# Altium schematic sheet Bridge.SchDoc: Full Bridge
size A4; ApprovedBy: LD Stanton; CheckedBy: None; Author: LD Stanton; CompanyName: University of Cape Town; DrawnBy: Lawrence Stanton; Engineer: Lawrence Stanton; Organization: University of Cape Town; Address1: Department of Electrical Engineering; Address2: Rondebosch; Address3: Cape Town; Address4: South Africa 7701; DocumentNumber: 1; SheetNumber: 1; SheetTotal: 1; Approv_Date_Eng: --/--/----; Approv_Date_Chk: --/--/----; PCB_Doc: TBD; ASM_Doc: TBD; FAB_Doc: TBD; CML_Doc: TBD; BOM_Doc: TBD
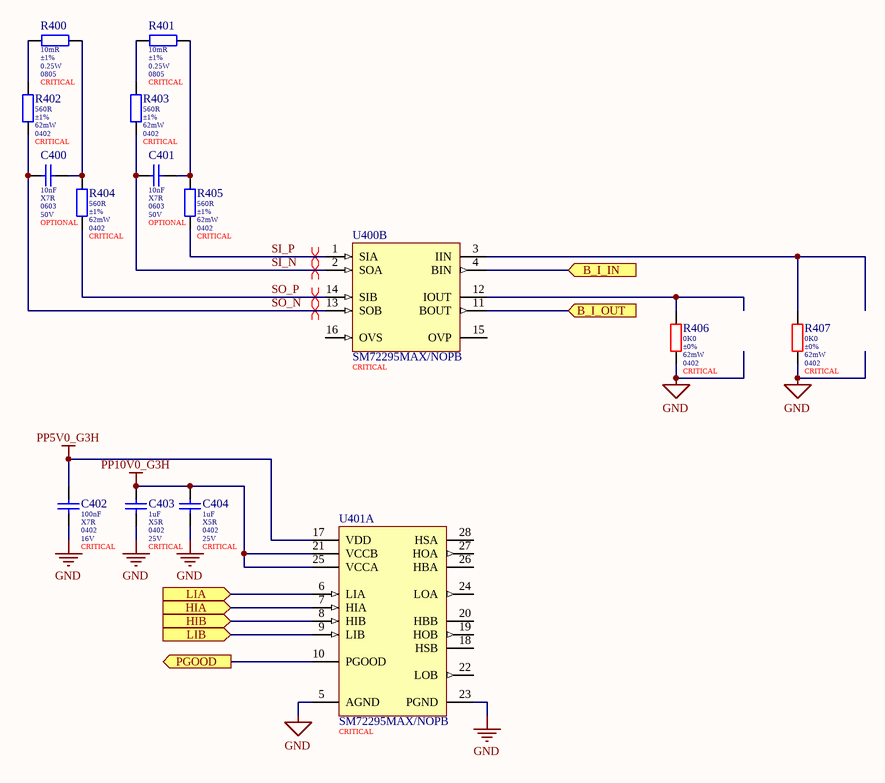
[diagram p0: Bridge.SchDoc]

## Parts
C400  value 10nF  Dielectric: X7R  Package: 0603  Voltage: 50V  Populate: OPTIONAL  [0603_080]  (hidden comment: MLCC 10nF 0603 50V X7R)
C401  value 10nF  Dielectric: X7R  Package: 0603  Voltage: 50V  Populate: OPTIONAL  [0603_080]  (hidden comment: MLCC 10nF 0603 50V X7R)
C402  value 100nF  Dielectric: X7R  Package: 0402  Voltage: 16V  Populate: CRITICAL  [0402_050_5_N]  (hidden comment: MLCC 100nF 0402 16V X7R)
C403  value 1uF  Dielectric: X5R  Package: 0402  Voltage: 25V  Populate: CRITICAL  [0402_050_5_N]  (hidden comment: MLCC 1uF 0402 25V X5R)
C404  value 1uF  Dielectric: X5R  Package: 0402  Voltage: 25V  Populate: CRITICAL  [0402_050_5_N]  (hidden comment: MLCC 1uF 0402 25V X5R)
R400  value 10mR  Tolerance: ±1%  Power: 0.25W  Populate: CRITICAL  [0805]  (hidden comment: 0805W4F100MT5E)
R401  value 10mR  Tolerance: ±1%  Power: 0.25W  Populate: CRITICAL  [0805]  (hidden comment: 0805W4F100MT5E)
R402  value 560R  Tolerance: ±1%  Power: 62mW  Populate: CRITICAL  [0402]  (hidden comment: 0402WGJ0561TCE)
R403  value 560R  Tolerance: ±1%  Power: 62mW  Populate: CRITICAL  [0402]  (hidden comment: 0402WGJ0561TCE)
R404  value 560R  Tolerance: ±1%  Power: 62mW  Populate: CRITICAL  [0402]  (hidden comment: 0402WGJ0561TCE)
R405  value 560R  Tolerance: ±1%  Power: 62mW  Populate: CRITICAL  [0402]  (hidden comment: 0402WGJ0561TCE)
R406  value 0K0  Tolerance: ±0%  Power: 62mW  Populate: CRITICAL  [0402]  (hidden comment: Resistor Generic 0402)
R407  value 0K0  Tolerance: ±0%  Power: 62mW  Populate: CRITICAL  [0402]  (hidden comment: Resistor Generic 0402)
U400  SM72295MAX/NOPB  Placement: CRITICAL  [DW0028A_L]  (part B of 2)
U401  SM72295MAX/NOPB  Placement: CRITICAL  [DW0028A_L]  (part A of 2)

## Ports
B_I_IN (in), B_I_OUT (in), HIA (in), HIB (in), LIA (in), LIB (in), PGOOD (out)

## Nets
GND: C402.2 C403.2 C404.2 R406.2 R407.2 U401.5(AGND) U401.23(PGND)
PP5V0_G3H: C402.1 U401.17(VDD)
PP10V0_G3H: C403.1 C404.1 U401.21(VCCB) U401.25(VCCA)
B_I_IN: U400.4(BIN) ; port B_I_IN
B_I_OUT: U400.11(BOUT) ; port B_I_OUT
HIA: U401.7(HIA) ; port HIA
HIB: U401.8(HIB) ; port HIB
LIA: U401.6(LIA) ; port LIA
LIB: U401.9(LIB) ; port LIB
PGOOD: U401.10(PGOOD) ; port PGOOD
SI_N: C401.1 R403.2 U400.2(SOA)
SI_P: R405.2 U400.1(SIA)
SO_N: C400.1 R402.2 U400.13(SOB)
SO_P: R404.2 U400.14(SIB)
NetC400_2: C400.2 R400.2 R404.1
NetC401_2: C401.2 R401.2 R405.1
NetR400_1: R400.1 R402.1
NetR401_1: R401.1 R403.1
NetR406_1: R406.1 U400.12(IOUT)
NetR407_1: R407.1 U400.3(IIN)

Not connected (* = marked no-connect by the designer): U400 15(OVP) 16(OVS); U401 18(HSB) 19(HOB) 20(HBB) 22(LOB) 24(LOA) 26(HBA) 27(HOA) 28(HSA)

## Layout directives
differential pair: SI_N, SI_P, SO_N, SO_P

## Notes on the sheet
- Size:
- Date:
- A4
- Number:
- Time:
- Revision:
- Sheet
- of
- File:
- Author:

## Library data of the parts
C400 C401 = CMP-014-000000-1: MLCC 10nF 0603 50V X7R ±10%; Pin Count: 2; ComponentLink1Description: Datasheet; LCSC Part Number: C57112; Source: MLCCs Guangdong.SchLib; Design Item ID: MLCC 10nF 0603 50V X7R; ComponentLink1URL: https://datasheet.lcsc.com/szlcsc/Guangdong-Fenghua-Advanced-Tech-0402B102K500NT_C1523.pdf; Tolerance: ±10%; Component Type: Standard
C402 = CMP-045-000014-1: MLCC 100nF 0402 16V X7R ±10%; Source: MLCCs Samsung.SchLib; Tolerance: ±10%; Design Item ID: MLCC 100nF 0402 16V X7R; ComponentLink1Description: Datasheet; ComponentLink1URL: https://datasheet.lcsc.com/szlcsc/Samsung-Electro-Mechanics-CL05C100JB5NNNC_C32949.pdf; LCSC Part Number: C1525
C403 C404 = CMP-045-000001-1: MLCC 1uF 0402 25V X5R ±10%; Source: MLCCs Samsung.SchLib; ComponentLink1Description: Datasheet; ComponentLink1URL: https://datasheet.lcsc.com/szlcsc/Samsung-Electro-Mechanics-CL05C100JB5NNNC_C32949.pdf; Tolerance: ±10%; Design Item ID: MLCC 1uF 0402 25V X5R; LCSC Part Number: C52923
R400 R401 = CMP-010-000353-2: Resistor 10mR 0805 ±1% Thick Film Uniroyal; Package: 0805; Pin Count: 2; LCSC Part Number: C270927; ComponentLink1Description: Datasheet; Source: Resistors.SchLib; Component Type: Standard; Design Item ID: Res 10mR 0805; ComponentLink1URL: https://datasheet.lcsc.com/szlcsc/1811062009_UNI-ROYAL-Uniroyal-Elec-0603WAF1002T5E_C25804.pdf; Temperature: -55 - 155°C
R402-R405 = CMP-010-000357-1: Resistor 560R 0402 ±1% Thick Film Uniroyal; Package: 0402; LCSC Part Number: C25172; ComponentLink1URL: https://datasheet.lcsc.com/szlcsc/1811062009_UNI-ROYAL-Uniroyal-Elec-0603WAF1002T5E_C25804.pdf; Component Type: Standard; ComponentLink1Description: Datasheet; Temperature: -55 - 155°C; Pin Count: 2; Source: Resistors.SchLib
R406 R407 = CMP-010-000355-2: Generic 0402 Ressitor; Package: 0402; ComponentLink1URL: https://datasheet.lcsc.com/szlcsc/1811062009_UNI-ROYAL-Uniroyal-Elec-0603WAF1002T5E_C25804.pdf; Pin Count: 2; Temperature: -55 - 155°C; Component Type: Standard; ComponentLink1Description: Datasheet
U400 = CMP-000000-5: Photovoltaic Full BridgeDriver 3A Non-Inv 28-Pin SOIC W T/R; ComponentLink1URL: https://www.ti.com/lit/ds/symlink/sm72295.pdf?HQS=dis-dk-null-digikeymode-dsf-pf-null-wwe&ts=1623830847089; ComponentLink1Description: Datasheet
U401 = CMP-000000-4: Photovoltaic Full BridgeDriver 3A Non-Inv 28-Pin SOIC W T/R; ComponentLink1URL: https://www.ti.com/lit/ds/symlink/sm72295.pdf?HQS=dis-dk-null-digikeymode-dsf-pf-null-wwe&ts=1623830847089; ComponentLink1Description: Datasheet